# EAGLE design MORPH RECONPLAT (EAGLE 7.1.0)
The Layout of Reconfigurable Platform. Developed by Daniel Graham LENS LAB The College of William and Mary
DESCRIPTION: The Layout of Reconfigurable Platform. Developed by Daniel Graham LENS LAB The College of William and Mary; DRAWING_AUTHOR: Daniel Graham LENS LAB W&N; TITLE: Reconfigurable Platform
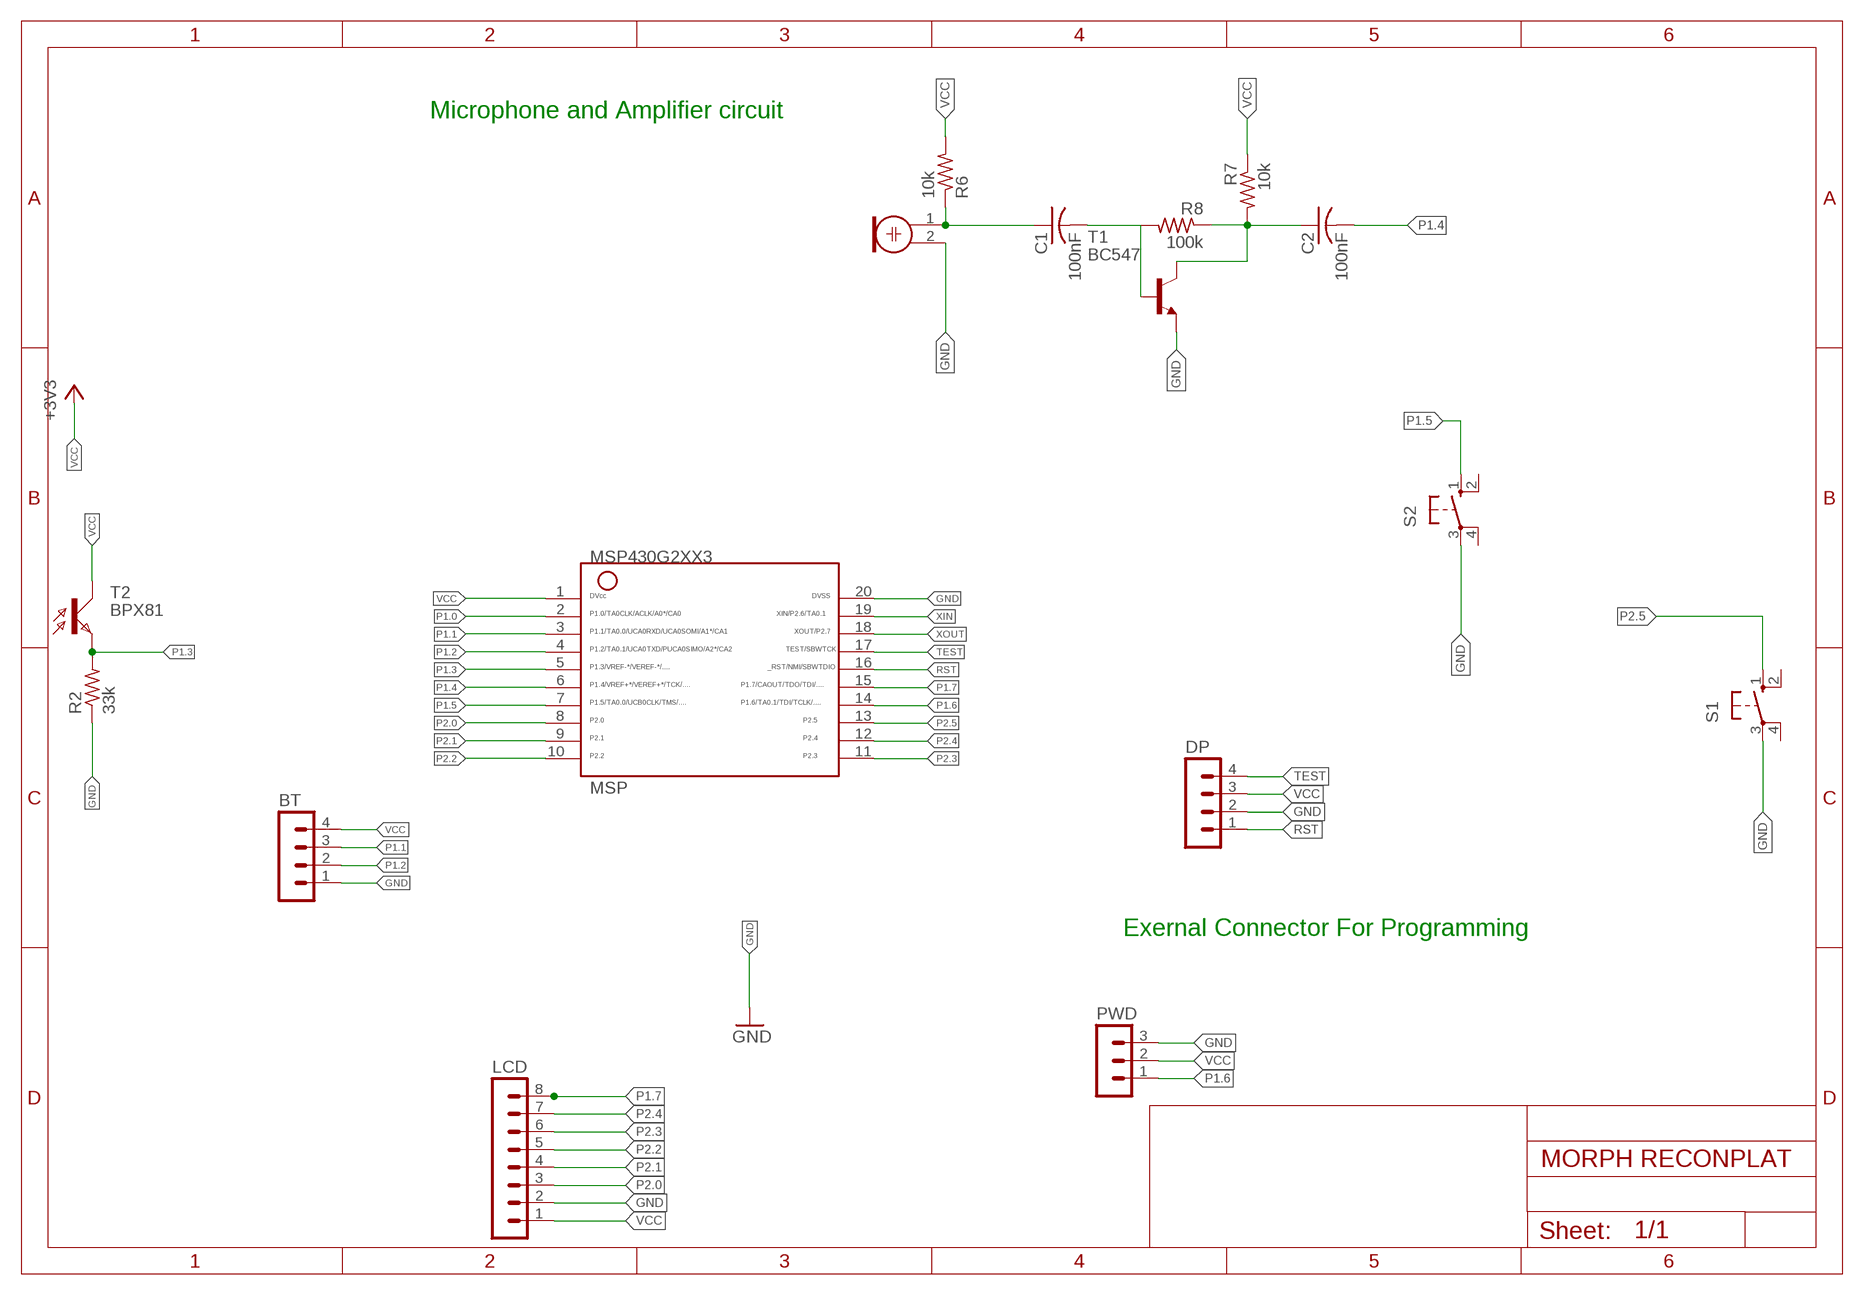
[diagram p0: schematic, sheet 1]

## Parts
BT  MA04-1  [MA04-1]
C1  100nF  C-US025-025X050  [C025-025X050]
C2  100nF  C-US025-025X050  [C025-025X050]
DP  MA04-1  [MA04-1]
LCD  MA08-1  [MA08-1]
M1  ELECTRET_MICROPHON-WM-64PC/64PK  [WM-64PC/64PK]
MSP  G2XX3---N20  [N20]
PWD  MA03-1  [MA03-1]
R2  33k  R-US_0207/10  [0207/10]
R6  10k  R-US_0207/10  [0207/10]
R7  10k  R-US_0207/10  [0207/10]
R8  100k  R-US_0207/10  [0207/10]
S1  10-XX  [B3F-10XX]
S2  10-XX  [B3F-10XX]
T1  BC547  [TO92]
T2  BPX81  [BPX81]

## Nets
GND: BT.1 DP.2 LCD.2 M1.2 MSP.20 PWD.3 R2.1 S1.3(P) S2.3(P) T1.1(E)
N$1: C1.1 M1.1 R6.1
N$2: C1.2 R8.2 T1.2(B)
N$3: C2.1 R7.2 R8.1 T1.3(C)
P1.0: MSP.2
P1.1: BT.3 MSP.3
P1.2: BT.2 MSP.4
P1.3: MSP.5 R2.2 T2.E
P1.4: C2.2 MSP.6
P1.5: MSP.7 S2.1(S)
P1.6: MSP.14 PWD.1
P1.7: LCD.8 MSP.15
P2.0: LCD.3 MSP.8
P2.1: LCD.4 MSP.9
P2.2: LCD.5 MSP.10
P2.3: LCD.6 MSP.11
P2.4: LCD.7 MSP.12
P2.5: MSP.13 S1.1(S)
RST: DP.1 MSP.16
TEST: DP.4 MSP.17
VCC: BT.4 DP.3 LCD.1 MSP.1 PWD.2 R6.2 R7.1 T2.C ; supply symbol labelled +3V3
XIN: MSP.19
XOUT: MSP.18
Unconnected: S1.2(S1) S1.4(P1) S2.2(S1) S2.4(P1)

## Notes on the sheet
- Microphone and Amplifier circuit
- Exernal Connector For Programming

## Library data of the parts
BT DP = con-lstb:MA04-1: PIN HEADER; OC_FARNELL: unknown; OC_NEWARK: unknown
C1 C2 = rcl:C-US: CAPACITOR, American symbol
LCD = con-lstb:MA08-1: PIN HEADER; OC_FARNELL: unknown; OC_NEWARK: unknown
M1 = microphon:ELECTRET_MICROPHON-: Electret Condenser Microphone
MSP = TI_MSP430_v16:G2XX3---N20: MSP430G2XX1 PDIP (N) 20 Pin Package
PWD = con-lstb:MA03-1: PIN HEADER; OC_FARNELL: unknown; OC_NEWARK: unknown
R2 R6-R8 = rcl:R-US_: RESISTOR, American symbol
S1 S2 = switch-omron:10-XX: OMRON SWITCH; MPN: B3F-1000; OC_FARNELL: 176432; OC_NEWARK: 36M3542
T1 = transistor:BC547: NPN TRANSISTOR
T2 = opto-trans-siemens:BPX81: PHOTO TRANSISTOR; OC_FARNELL: unknown; OC_NEWARK: unknown

## Board
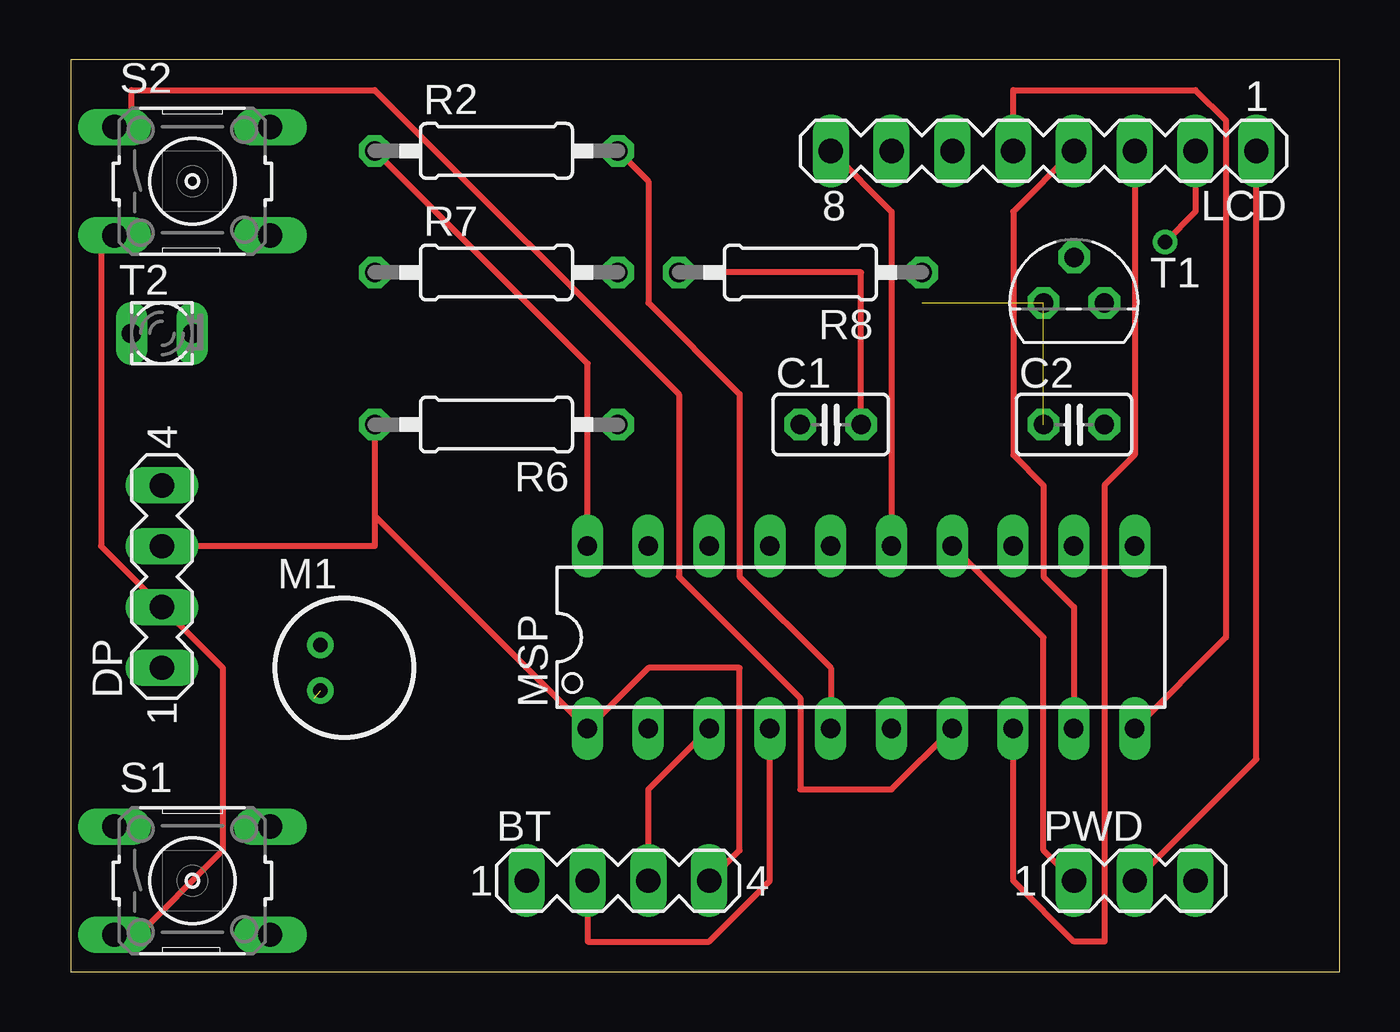
[diagram p1: board, top side]
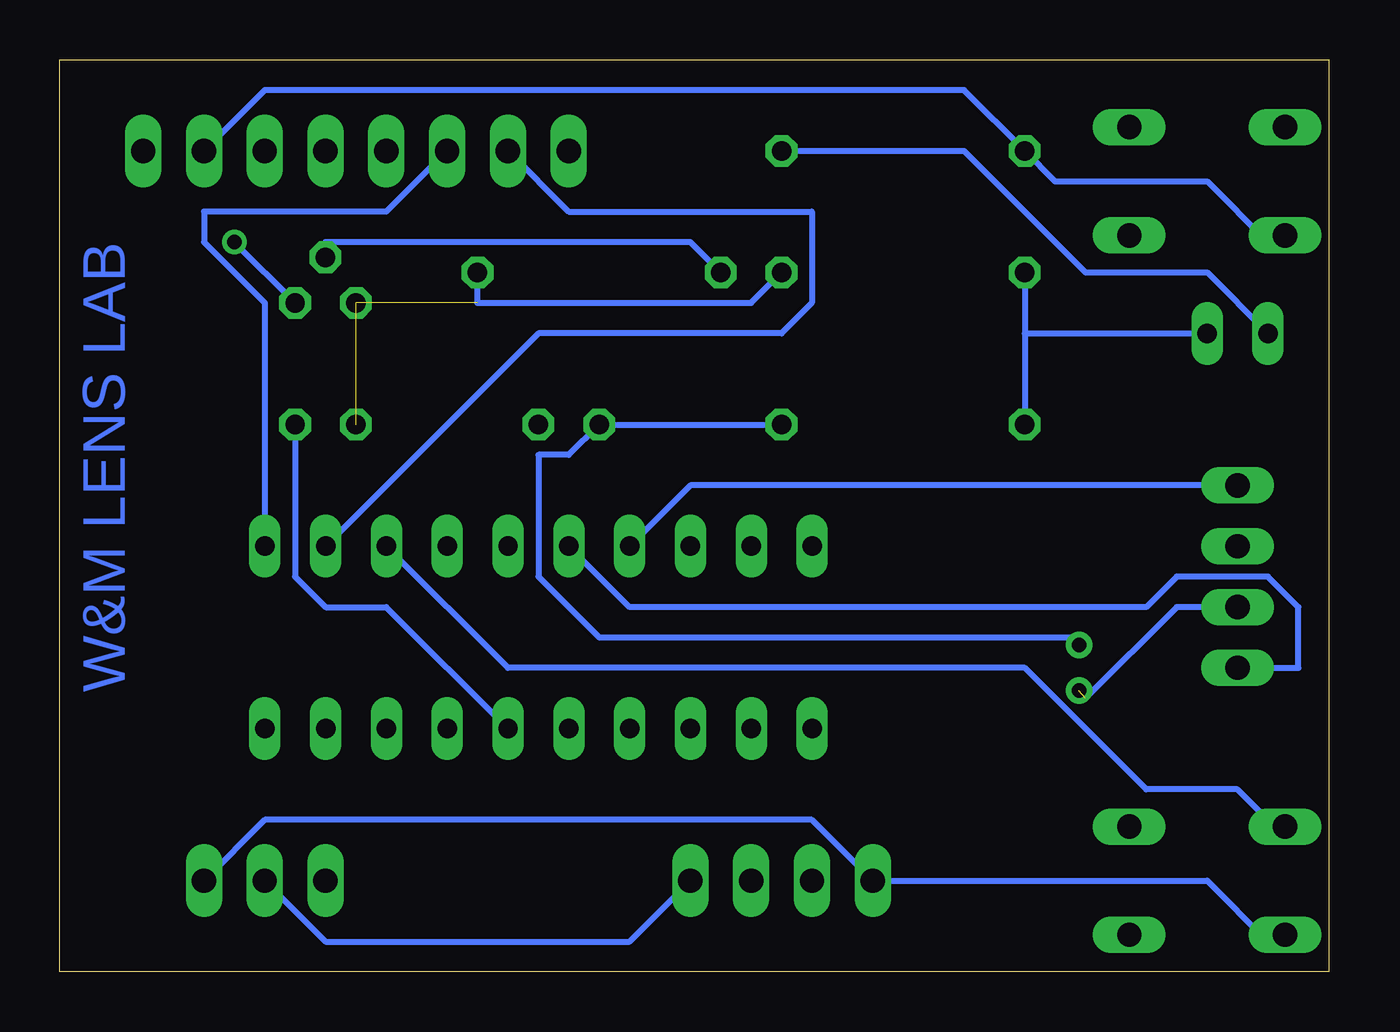
[diagram p2: board, bottom side, seen from below]

Size 53.01 x 38.09 mm. Coordinates in mm from the lower left corner, seen from the top.
Outline: 0,0 53.01,0 53.01,38.09 0,38.09 0,0
Copper layers (1*16): Top 0.035mm / dielectric 1.5mm / Bottom 0.035mm
Design rules "default": minimum track width 10mil, minimum drill 24mil, track to track 8mil, track to pad 8mil, pad to pad 8mil, via to via 8mil, smd to smd 8mil, copper to edge 40mil, drill to drill 8mil, minimum pad ring 10mil, minimum via ring 8mil, stop-mask expansion 4mil, vias tented up to drill 0mil, thermal gap 10mil

### Footprints (pad centres in the part's own frame; a part is rotated, then mirrored left to right if it is on the bottom)
MA04-1 = drill 1.016 long: 1 -3.81,0; 2 -1.27,0; 3 1.27,0; 4 3.81,0
C025-025X050 = drill 0.813 octagon: 1 -1.27,0; 2 1.27,0
MA08-1 = drill 1.016 long: 1 -8.89,0; 2 -6.35,0; 3 -3.81,0; 4 -1.27,0; 5 1.27,0; 6 3.81,0; 7 6.35,0; 8 8.89,0
WM-64PC/64PK = drill 0.6 pad 1: 1 -1,0.95; 2 -1,-0.95
N20 = drill 0.813 long: 1 -11.435,-3.81; 2 -8.895,-3.81; 3 -6.355,-3.81; 4 -3.815,-3.81; 5 -1.275,-3.81; 6 1.265,-3.81; 7 3.805,-3.81; 8 6.345,-3.81; 9 8.885,-3.81; 10 11.425,-3.81; 11 11.425,3.81; 12 8.885,3.81; 13 6.345,3.81; 14 3.805,3.81; 15 1.265,3.81; 16 -1.275,3.81; 17 -3.815,3.81; 18 -6.355,3.81; 19 -8.895,3.81; 20 -11.435,3.81
MA03-1 = drill 1.016 long: 1 -2.54,0; 2 0,0; 3 2.54,0
0207/10 = drill 0.813 octagon: 1 -5.08,0; 2 5.08,0
B3F-10XX = drill 1.016 long: 1 -3.251,2.261; 2 3.251,2.261; 3 -3.251,-2.261; 4 3.251,-2.261
TO92 = drill 0.813 octagon: 1 1.27,0; 2 0,1.905; 3 -1.27,0
BPX81 = drill 0.813 long: C 1.27,0; E -1.27,0

### Placement (x,y rotation side)
BT  22.86,3.81 0 top
C1  31.75,22.86 0 top
C2  41.91,22.86 0 top
DP  3.81,16.51 90 top
LCD  40.64,34.29 180 top
M1  11.43,12.7 0 top
MSP  33.02,13.97 0 top
PWD  44.45,3.81 0 top
R2  17.78,34.29 0 top
R6  17.78,22.86 180 top
R7  17.78,29.21 0 top
R8  30.48,29.21 180 top
S1  5.08,3.81 0 top
S2  5.08,33.02 0 top
T1  41.91,27.94 0 top
T2  3.81,26.67 0 top

### Tracks (layer width: path | path; a pad name or v marks a point on that pad's centre or on a via)
GND  (via drill 0.61)  (1 unrouted)
  Top 0.254: v45.72,30.48 46.99,31.75 LCD.2 | R2.1 21.59,25.4 MSP.20 | S2.3 1.27,30.48 1.27,17.78 DP.2 6.35,12.7 6.35,5.08 2.54,1.27 S1.3
  Bottom 0.254: S1.3 2.54,1.27 5.08,3.81 BT.1 21.59,6.35 44.45,6.35 PWD.3 | v45.72,30.48 T1.1 | 10.16,11.43 6.35,15.24 DP.2 | S2.3 2.54,30.48 5.08,33.02 11.43,33.02 R2.1 15.24,36.83 44.45,36.83 LCD.2
N$1
  Bottom 0.254: M1.1 10.16,13.97 30.48,13.97 33.02,16.51 33.02,21.59 31.75,21.59 C1.1 R6.1
N$2
  Top 0.254: R8.2 33.02,29.21 C1.2
  Bottom 0.254: R8.2 26.67,30.48 41.91,30.48 T1.2
N$3  (2 unrouted)
  Bottom 0.254: R7.2 24.13,27.94 35.56,27.94 R8.1
P1.1
  Top 0.254: BT.3 24.13,7.62 MSP.3
P1.2
  Top 0.254: BT.2 21.59,1.27 26.67,1.27 29.21,3.81 MSP.4
P1.3
  Top 0.254: R2.2 24.13,33.02 24.13,27.94 27.94,24.13 27.94,16.51 31.75,12.7 MSP.5
  Bottom 0.254: T2.E 5.08,29.21 10.16,29.21 15.24,34.29 R2.2
P1.4
  Bottom 0.254: C2.2 43.18,16.51 41.91,15.24 39.37,15.24 MSP.6
P1.5
  Top 0.254: MSP.7 34.29,7.62 30.48,7.62 30.48,11.43 25.4,16.51 25.4,24.13 12.7,36.83 2.54,36.83 2.54,35.56 S2.1
P1.6
  Top 0.254: PWD.1 40.64,5.08 40.64,13.97 MSP.14
P1.7
  Top 0.254: LCD.8 34.29,31.75 MSP.15
P2.0
  Top 0.254: LCD.3 44.45,21.59 43.18,20.32 43.18,1.27 41.91,1.27 39.37,3.81 MSP.8
P2.1
  Top 0.254: LCD.4 39.37,31.75 39.37,21.59 40.64,20.32 40.64,16.51 41.91,15.24 MSP.9
P2.2
  Top 0.254: LCD.5 39.37,36.83 46.99,36.83 48.26,35.56 48.26,13.97 MSP.10
P2.3
  Bottom 0.254: LCD.6 39.37,31.75 46.99,31.75 46.99,30.48 44.45,27.94 MSP.11
P2.4
  Bottom 0.254: LCD.7 31.75,31.75 21.59,31.75 21.59,27.94 22.86,26.67 33.02,26.67 MSP.12
P2.5
  Bottom 0.254: MSP.13 34.29,12.7 12.7,12.7 7.62,7.62 3.81,7.62 2.54,6.35 S1.1
RST
  Bottom 0.254: DP.1 1.27,12.7 1.27,15.24 2.54,16.51 6.35,16.51 7.62,15.24 29.21,15.24 MSP.16
TEST
  Bottom 0.254: DP.4 26.67,20.32 MSP.17
VCC
  Top 0.254: 12.7,19.05 MSP.1 | R6.2 12.7,19.05 | DP.3 12.7,17.78 12.7,19.05 | LCD.1 49.53,8.89 PWD.2 | MSP.1 24.13,12.7 27.94,12.7 27.94,5.08 BT.4 | MSP.1
  Bottom 0.254: R7.1 12.7,26.67 | 12.7,26.67 R6.2 | 12.7,26.67 T2.C | BT.4 29.21,1.27 41.91,1.27 PWD.2

### Text on the board
Bottom: W&M LENS LAB